# EAGLE board 7SEG_STATUS_1 (EAGLE 6.5.0)
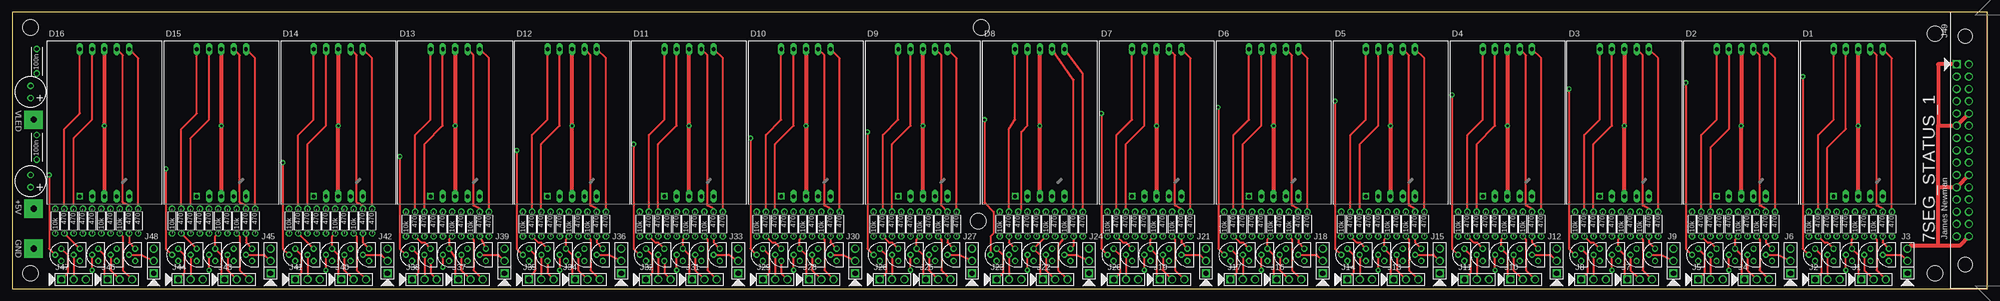
[diagram p9: board, top side]
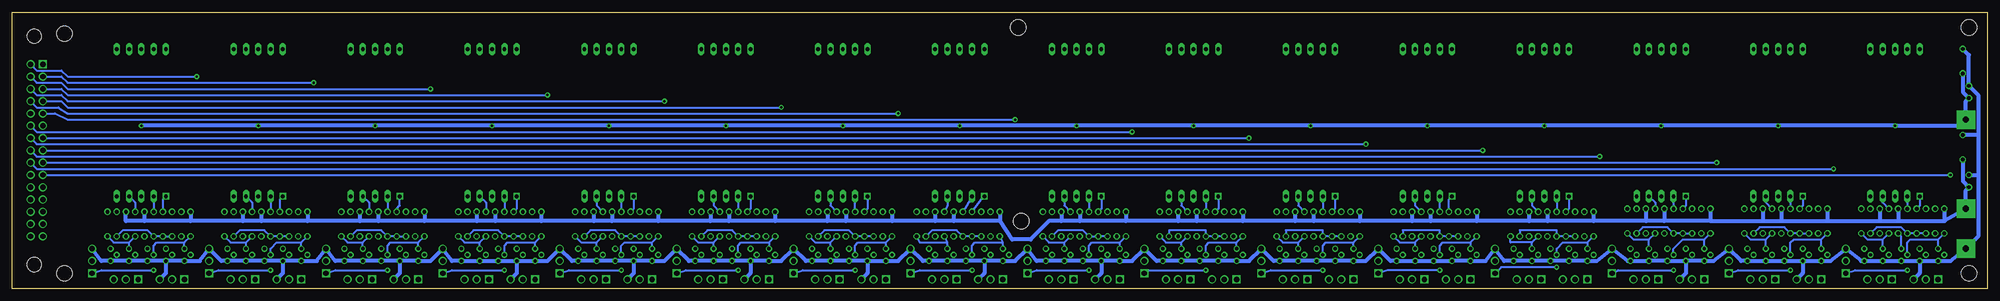
[diagram p10: board, bottom side, seen from below]

Size 407.67 x 57.15 mm. Coordinates in mm from the lower left corner, seen from the top.
Outline: 0,0 407.67,0 407.67,57.15 0,57.15 0,0
Copper layers (1*16): Top 0.035mm / dielectric 1.5mm / Bottom 0.035mm
Design rules "processor_rules_2layer": minimum track width 8mil, minimum drill 14mil, track to track 8mil, track to pad 8mil, pad to pad 8mil, via to via 8mil, smd to smd 8mil, copper to edge 40mil, drill to drill 8mil, minimum pad ring 10mil, minimum via ring 8mil, stop-mask expansion 4mil, vias tented up to drill 0mil, thermal gap 10mil

## Footprints (pad centres in the part's own frame; a part is rotated, then mirrored left to right if it is on the bottom)
POLARISED_CAP_2P5_6P3MM = drill 0.8: A 1.27,0; K -1.27,0
CAP_P2INCH = drill 0.8: 1 -2.54,0; 2 2.54,0
SA10 = drill 0.8 square: 1 -5.08,-15.2 | drill 0.8 long: 2 -2.54,-15.2; 3 0,-15.2; 4 2.54,-15.2; 5 5.08,-15.2; 6 5.08,15.2; 7 2.54,15.2; 8 0,15.2; 9 -2.54,15.2; 10 -5.08,15.2
3M_HOLE = hole 3.2: 0,0
JUMP_3X1 = drill 1.1 square: 1 -2.54,0 | drill 1.1: 2 0,0; 3 2.54,0
30_HDR_LOCKING_RA = drill 1.1 square: 1 -17.78,-1.27 | drill 1.1: 2 -17.78,1.27; 3 -15.24,-1.27; 4 -15.24,1.27; 5 -12.7,-1.27; 6 -12.7,1.27; 7 -10.16,-1.27; 8 -10.16,1.27; 9 -7.62,-1.27; 10 -7.62,1.27; 11 -5.08,-1.27; 12 -5.08,1.27; 13 -2.54,-1.27; 14 -2.54,1.27; 15 0,-1.27; 16 0,1.27; 17 2.54,-1.27; 18 2.54,1.27; 19 5.08,-1.27; 20 5.08,1.27; 21 7.62,-1.27; 22 7.62,1.27; 23 10.16,-1.27; 24 10.16,1.27; 25 12.7,-1.27; 26 12.7,1.27; 27 15.24,-1.27; 28 15.24,1.27; 29 17.78,-1.27; 30 17.78,1.27 | hole 2.946: -23.597,0.533; 23.597,0.533
POWER_PAD = drill 1.3 pad 3.81 square: 1 0,0
TO92-DGS = drill 0.7: D 0,1.27; G -1.27,0; S 0,-1.27
R_P2INCH = drill 0.8: 1 -2.54,0; 2 2.54,0

## Placement (x,y rotation side)
C1  100u  [POLARISED_CAP_2P5_6P3MM]  3.81,22.23 270 top
C2  100u  [POLARISED_CAP_2P5_6P3MM]  3.81,40.64 270 top
C3  100n  [CAP_P2INCH]  5.08,29.21 90 top
C4  100n  [CAP_P2INCH]  5.08,46.99 90 top
D1  SA10-21SRWA  [SA10]  381,34.29 0 top
D2  SA10-21SRWA  [SA10]  356.87,34.29 0 top
D3  SA10-21SRWA  [SA10]  332.74,34.29 0 top
D4  SA10-21SRWA  [SA10]  308.61,34.29 0 top
D5  SA10-21SRWA  [SA10]  284.48,34.29 0 top
D6  SA10-21SRWA  [SA10]  260.35,34.29 0 top
D7  SA10-21SRWA  [SA10]  236.22,34.29 0 top
D8  SA10-21SRWA  [SA10]  212.09,34.29 0 top
D9  SA10-21SRWA  [SA10]  187.96,34.29 0 top
D10  SA10-21SRWA  [SA10]  163.83,34.29 0 top
D11  SA10-21SRWA  [SA10]  139.7,34.29 0 top
D12  SA10-21SRWA  [SA10]  115.57,34.29 0 top
D13  SA10-21SRWA  [SA10]  91.44,34.29 0 top
D14  SA10-21SRWA  [SA10]  67.31,34.29 0 top
D15  SA10-21SRWA  [SA10]  43.18,34.29 0 top
D16  SA10-21SRWA  [SA10]  19.05,34.29 0 top
HOLE1  3M_MOUNT_HOLE  [3M_HOLE]  396.88,52.7 0 top
HOLE2  3M_MOUNT_HOLE  [3M_HOLE]  396.88,3.17 0 top
HOLE3  3M_MOUNT_HOLE  [3M_HOLE]  3.81,53.98 0 top
HOLE4  3M_MOUNT_HOLE  [3M_HOLE]  3.81,3.17 0 top
HOLE5  3M_MOUNT_HOLE  [3M_HOLE]  199.39,13.97 0 top
HOLE6  3M_MOUNT_HOLE  [3M_HOLE]  200.03,53.98 0 top
J1  JUMP_3X1  [JUMP_3X1]  384.18,1.91 0 top
J2  JUMP_3X1  [JUMP_3X1]  374.65,1.91 0 top
J3  JUMP_3X1  [JUMP_3X1]  391.16,5.71 90 top
J4  JUMP_3X1  [JUMP_3X1]  360.05,1.91 0 top
J5  JUMP_3X1  [JUMP_3X1]  350.52,1.91 0 top
J6  JUMP_3X1  [JUMP_3X1]  367.03,5.71 90 top
J7  JUMP_3X1  [JUMP_3X1]  335.92,1.91 0 top
J8  JUMP_3X1  [JUMP_3X1]  326.39,1.91 0 top
J9  JUMP_3X1  [JUMP_3X1]  342.9,5.71 90 top
J10  JUMP_3X1  [JUMP_3X1]  311.79,1.91 0 top
J11  JUMP_3X1  [JUMP_3X1]  302.26,1.91 0 top
J12  JUMP_3X1  [JUMP_3X1]  318.77,5.71 90 top
J13  JUMP_3X1  [JUMP_3X1]  287.65,1.91 0 top
J14  JUMP_3X1  [JUMP_3X1]  278.13,1.91 0 top
J15  JUMP_3X1  [JUMP_3X1]  294.64,5.71 90 top
J16  JUMP_3X1  [JUMP_3X1]  263.52,1.91 0 top
J17  JUMP_3X1  [JUMP_3X1]  254,1.91 0 top
J18  JUMP_3X1  [JUMP_3X1]  270.51,5.71 90 top
J19  JUMP_3X1  [JUMP_3X1]  239.4,1.91 0 top
J20  JUMP_3X1  [JUMP_3X1]  229.87,1.91 0 top
J21  JUMP_3X1  [JUMP_3X1]  246.38,5.71 90 top
J22  JUMP_3X1  [JUMP_3X1]  215.26,1.91 0 top
J23  JUMP_3X1  [JUMP_3X1]  205.74,1.91 0 top
J24  JUMP_3X1  [JUMP_3X1]  222.25,5.71 90 top
J25  JUMP_3X1  [JUMP_3X1]  191.13,1.91 0 top
J26  JUMP_3X1  [JUMP_3X1]  181.61,1.91 0 top
J27  JUMP_3X1  [JUMP_3X1]  198.12,5.71 90 top
J28  JUMP_3X1  [JUMP_3X1]  167,1.91 0 top
J29  JUMP_3X1  [JUMP_3X1]  157.48,1.91 0 top
J30  JUMP_3X1  [JUMP_3X1]  173.99,5.71 90 top
J31  JUMP_3X1  [JUMP_3X1]  142.88,1.91 0 top
J32  JUMP_3X1  [JUMP_3X1]  133.35,1.91 0 top
J33  JUMP_3X1  [JUMP_3X1]  149.86,5.71 90 top
J34  JUMP_3X1  [JUMP_3X1]  118.75,1.91 0 top
J35  JUMP_3X1  [JUMP_3X1]  109.22,1.91 0 top
J36  JUMP_3X1  [JUMP_3X1]  125.73,5.71 90 top
J37  JUMP_3X1  [JUMP_3X1]  94.61,1.91 0 top
J38  JUMP_3X1  [JUMP_3X1]  85.09,1.91 0 top
J39  JUMP_3X1  [JUMP_3X1]  101.6,5.71 90 top
J40  JUMP_3X1  [JUMP_3X1]  70.48,1.91 0 top
J41  JUMP_3X1  [JUMP_3X1]  60.96,1.91 0 top
J42  JUMP_3X1  [JUMP_3X1]  77.47,5.71 90 top
J43  JUMP_3X1  [JUMP_3X1]  46.35,1.91 0 top
J44  JUMP_3X1  [JUMP_3X1]  36.83,1.91 0 top
J45  JUMP_3X1  [JUMP_3X1]  53.34,5.71 90 top
J46  JUMP_3X1  [JUMP_3X1]  22.23,1.91 0 top
J47  JUMP_3X1  [JUMP_3X1]  12.7,1.91 0 top
J48  JUMP_3X1  [JUMP_3X1]  29.21,5.71 90 top
J49  30_HDR_LOCKING_RA  [30_HDR_LOCKING_RA]  402.59,28.57 270 top
PP1  POWER_PAD  [POWER_PAD]  4.45,8.26 0 top
PP2  POWER_PAD  [POWER_PAD]  4.45,16.51 0 top
PP3  POWER_PAD  [POWER_PAD]  4.45,34.92 0 top
Q1  2N7000  [TO92-DGS]  383.54,6.99 0 top
Q2  2N7000  [TO92-DGS]  375.92,6.99 0 top
Q3  2N7000  [TO92-DGS]  387.35,6.99 0 top
Q4  2N7000  [TO92-DGS]  372.11,6.99 0 top
Q5  2N7000  [TO92-DGS]  379.73,6.99 0 top
Q6  2N7000  [TO92-DGS]  359.41,6.99 0 top
Q7  2N7000  [TO92-DGS]  351.79,6.99 0 top
Q8  2N7000  [TO92-DGS]  363.22,6.99 0 top
Q9  2N7000  [TO92-DGS]  347.98,6.99 0 top
Q10  2N7000  [TO92-DGS]  355.6,6.99 0 top
Q11  2N7000  [TO92-DGS]  335.28,6.99 0 top
Q12  2N7000  [TO92-DGS]  327.66,6.99 0 top
Q13  2N7000  [TO92-DGS]  339.09,6.99 0 top
Q14  2N7000  [TO92-DGS]  323.85,6.99 0 top
Q15  2N7000  [TO92-DGS]  331.47,6.99 0 top
Q16  2N7000  [TO92-DGS]  311.15,6.99 0 top
Q17  2N7000  [TO92-DGS]  303.53,6.99 0 top
Q18  2N7000  [TO92-DGS]  314.96,6.99 0 top
Q19  2N7000  [TO92-DGS]  299.72,6.99 0 top
Q20  2N7000  [TO92-DGS]  307.34,6.99 0 top
Q21  2N7000  [TO92-DGS]  287.02,6.99 0 top
Q22  2N7000  [TO92-DGS]  279.4,6.99 0 top
Q23  2N7000  [TO92-DGS]  290.83,6.99 0 top
Q24  2N7000  [TO92-DGS]  275.59,6.99 0 top
Q25  2N7000  [TO92-DGS]  283.21,6.99 0 top
Q26  2N7000  [TO92-DGS]  262.89,6.99 0 top
Q27  2N7000  [TO92-DGS]  255.27,6.99 0 top
Q28  2N7000  [TO92-DGS]  266.7,6.99 0 top
Q29  2N7000  [TO92-DGS]  251.46,6.99 0 top
Q30  2N7000  [TO92-DGS]  259.08,6.99 0 top
Q31  2N7000  [TO92-DGS]  238.76,6.99 0 top
Q32  2N7000  [TO92-DGS]  231.14,6.99 0 top
Q33  2N7000  [TO92-DGS]  242.57,6.99 0 top
Q34  2N7000  [TO92-DGS]  227.33,6.99 0 top
Q35  2N7000  [TO92-DGS]  234.95,6.99 0 top
Q36  2N7000  [TO92-DGS]  214.63,6.99 0 top
Q37  2N7000  [TO92-DGS]  207.01,6.99 0 top
Q38  2N7000  [TO92-DGS]  218.44,6.99 0 top
Q39  2N7000  [TO92-DGS]  203.2,6.99 0 top
Q40  2N7000  [TO92-DGS]  210.82,6.99 0 top
Q41  2N7000  [TO92-DGS]  190.5,6.99 0 top
Q42  2N7000  [TO92-DGS]  182.88,6.99 0 top
Q43  2N7000  [TO92-DGS]  194.31,6.99 0 top
Q44  2N7000  [TO92-DGS]  179.07,6.99 0 top
Q45  2N7000  [TO92-DGS]  186.69,6.99 0 top
Q46  2N7000  [TO92-DGS]  166.37,6.99 0 top
Q47  2N7000  [TO92-DGS]  158.75,6.99 0 top
Q48  2N7000  [TO92-DGS]  170.18,6.99 0 top
Q49  2N7000  [TO92-DGS]  154.94,6.99 0 top
Q50  2N7000  [TO92-DGS]  162.56,6.99 0 top
Q51  2N7000  [TO92-DGS]  142.24,6.99 0 top
Q52  2N7000  [TO92-DGS]  134.62,6.99 0 top
Q53  2N7000  [TO92-DGS]  146.05,6.99 0 top
Q54  2N7000  [TO92-DGS]  130.81,6.99 0 top
Q55  2N7000  [TO92-DGS]  138.43,6.99 0 top
Q56  2N7000  [TO92-DGS]  118.11,6.99 0 top
Q57  2N7000  [TO92-DGS]  110.49,6.99 0 top
Q58  2N7000  [TO92-DGS]  121.92,6.99 0 top
Q59  2N7000  [TO92-DGS]  106.68,6.99 0 top
Q60  2N7000  [TO92-DGS]  114.3,6.99 0 top
Q61  2N7000  [TO92-DGS]  93.98,6.99 0 top
Q62  2N7000  [TO92-DGS]  86.36,6.99 0 top
Q63  2N7000  [TO92-DGS]  97.79,6.99 0 top
Q64  2N7000  [TO92-DGS]  82.55,6.99 0 top
Q65  2N7000  [TO92-DGS]  90.17,6.99 0 top
Q66  2N7000  [TO92-DGS]  69.85,6.99 0 top
Q67  2N7000  [TO92-DGS]  62.23,6.99 0 top
Q68  2N7000  [TO92-DGS]  73.66,6.99 0 top
Q69  2N7000  [TO92-DGS]  58.42,6.99 0 top
Q70  2N7000  [TO92-DGS]  66.04,6.99 0 top
Q71  2N7000  [TO92-DGS]  45.72,6.99 0 top
Q72  2N7000  [TO92-DGS]  38.1,6.99 0 top
Q73  2N7000  [TO92-DGS]  49.53,6.99 0 top
Q74  2N7000  [TO92-DGS]  34.29,6.99 0 top
Q75  2N7000  [TO92-DGS]  41.91,6.99 0 top
Q76  2N7000  [TO92-DGS]  21.59,6.99 0 top
Q77  2N7000  [TO92-DGS]  13.97,6.99 0 top
Q78  2N7000  [TO92-DGS]  25.4,6.99 0 top
Q79  2N7000  [TO92-DGS]  10.16,6.99 0 top
Q80  2N7000  [TO92-DGS]  17.78,6.99 0 top
R1  470  [R_P2INCH]  376.56,13.34 270 top
R2  470  [R_P2INCH]  374.65,13.34 270 top
R3  470  [R_P2INCH]  372.75,13.34 270 top
R4  10k  [R_P2INCH]  370.84,13.34 90 top
R5  10k  [R_P2INCH]  380.37,13.34 90 top
R6  10k  [R_P2INCH]  384.18,13.34 90 top
R7  470  [R_P2INCH]  352.43,13.34 270 top
R8  470  [R_P2INCH]  350.52,13.34 270 top
R9  470  [R_P2INCH]  348.62,13.34 270 top
R10  10k  [R_P2INCH]  346.71,13.34 90 top
R11  10k  [R_P2INCH]  356.24,13.34 90 top
R12  10k  [R_P2INCH]  360.05,13.34 90 top
R13  470  [R_P2INCH]  328.3,13.34 270 top
R14  470  [R_P2INCH]  326.39,13.34 270 top
R15  470  [R_P2INCH]  324.49,13.34 270 top
R16  10k  [R_P2INCH]  322.58,13.34 90 top
R17  10k  [R_P2INCH]  332.11,13.34 90 top
R18  10k  [R_P2INCH]  335.92,13.34 90 top
R19  470  [R_P2INCH]  304.17,13.34 270 top
R20  470  [R_P2INCH]  302.26,13.34 270 top
R21  470  [R_P2INCH]  300.36,13.34 270 top
R22  10k  [R_P2INCH]  298.45,13.34 90 top
R23  10k  [R_P2INCH]  307.98,13.34 90 top
R24  10k  [R_P2INCH]  311.79,13.34 90 top
R25  470  [R_P2INCH]  280.04,13.34 270 top
R26  470  [R_P2INCH]  278.13,13.34 270 top
R27  470  [R_P2INCH]  276.23,13.34 270 top
R28  10k  [R_P2INCH]  274.32,13.34 90 top
R29  10k  [R_P2INCH]  283.85,13.34 90 top
R30  10k  [R_P2INCH]  287.65,13.34 90 top
R31  470  [R_P2INCH]  255.91,13.34 270 top
R32  470  [R_P2INCH]  254,13.34 270 top
R33  470  [R_P2INCH]  252.09,13.34 270 top
R34  10k  [R_P2INCH]  250.19,13.34 90 top
R35  10k  [R_P2INCH]  259.71,13.34 90 top
R36  10k  [R_P2INCH]  263.52,13.34 90 top
R37  470  [R_P2INCH]  231.78,13.34 270 top
R38  470  [R_P2INCH]  229.87,13.34 270 top
R39  470  [R_P2INCH]  227.97,13.34 270 top
R40  10k  [R_P2INCH]  226.06,13.34 90 top
R41  10k  [R_P2INCH]  235.59,13.34 90 top
R42  10k  [R_P2INCH]  239.4,13.34 90 top
R43  470  [R_P2INCH]  209.55,13.34 270 top
R44  470  [R_P2INCH]  207.65,13.34 270 top
R45  470  [R_P2INCH]  205.74,13.34 270 top
R46  10k  [R_P2INCH]  203.84,13.34 90 top
R47  10k  [R_P2INCH]  213.36,13.34 90 top
R48  10k  [R_P2INCH]  217.17,13.34 90 top
R49  470  [R_P2INCH]  183.51,13.34 270 top
R50  470  [R_P2INCH]  181.61,13.34 270 top
R51  470  [R_P2INCH]  179.71,13.34 270 top
R52  10k  [R_P2INCH]  177.8,13.34 90 top
R53  10k  [R_P2INCH]  187.32,13.34 90 top
R54  10k  [R_P2INCH]  191.13,13.34 90 top
R55  470  [R_P2INCH]  159.38,13.34 270 top
R56  470  [R_P2INCH]  157.48,13.34 270 top
R57  470  [R_P2INCH]  155.57,13.34 270 top
R58  10k  [R_P2INCH]  153.67,13.34 90 top
R59  10k  [R_P2INCH]  163.19,13.34 90 top
R60  10k  [R_P2INCH]  167,13.34 90 top
R61  470  [R_P2INCH]  135.25,13.34 270 top
R62  470  [R_P2INCH]  133.35,13.34 270 top
R63  470  [R_P2INCH]  131.44,13.34 270 top
R64  10k  [R_P2INCH]  129.54,13.34 90 top
R65  10k  [R_P2INCH]  139.06,13.34 90 top
R66  10k  [R_P2INCH]  142.88,13.34 90 top
R67  470  [R_P2INCH]  111.12,13.34 270 top
R68  470  [R_P2INCH]  109.22,13.34 270 top
R69  470  [R_P2INCH]  107.31,13.34 270 top
R70  10k  [R_P2INCH]  105.41,13.34 90 top
R71  10k  [R_P2INCH]  114.94,13.34 90 top
R72  10k  [R_P2INCH]  118.75,13.34 90 top
R73  470  [R_P2INCH]  87,13.34 270 top
R74  470  [R_P2INCH]  85.09,13.34 270 top
R75  470  [R_P2INCH]  83.19,13.34 270 top
R76  10k  [R_P2INCH]  81.28,13.34 90 top
R77  10k  [R_P2INCH]  90.81,13.34 90 top
R78  10k  [R_P2INCH]  94.61,13.34 90 top
R79  470  [R_P2INCH]  62.87,13.97 270 top
R80  470  [R_P2INCH]  60.96,13.97 270 top
R81  470  [R_P2INCH]  59.05,13.97 270 top
R82  10k  [R_P2INCH]  57.15,13.97 90 top
R83  10k  [R_P2INCH]  66.67,13.97 90 top
R84  10k  [R_P2INCH]  70.48,13.97 90 top
R85  470  [R_P2INCH]  38.73,13.97 270 top
R86  470  [R_P2INCH]  36.83,13.97 270 top
R87  470  [R_P2INCH]  34.92,13.97 270 top
R88  10k  [R_P2INCH]  33.02,13.97 90 top
R89  10k  [R_P2INCH]  42.55,13.97 90 top
R90  10k  [R_P2INCH]  46.35,13.97 90 top
R91  470  [R_P2INCH]  14.61,13.97 270 top
R92  470  [R_P2INCH]  12.7,13.97 270 top
R93  470  [R_P2INCH]  10.79,13.97 270 top
R94  10k  [R_P2INCH]  8.89,13.97 90 top
R95  10k  [R_P2INCH]  18.41,13.97 90 top
R96  10k  [R_P2INCH]  22.23,13.97 90 top
R97  470  [R_P2INCH]  64.77,13.97 270 top
R98  470  [R_P2INCH]  68.58,13.97 270 top
R99  470  [R_P2INCH]  74.3,13.97 270 top
R100  470  [R_P2INCH]  72.39,13.97 270 top
R101  470  [R_P2INCH]  88.9,13.34 270 top
R102  470  [R_P2INCH]  92.71,13.34 270 top
R103  470  [R_P2INCH]  98.42,13.34 270 top
R104  470  [R_P2INCH]  96.52,13.34 270 top
R105  470  [R_P2INCH]  40.64,13.97 270 top
R106  470  [R_P2INCH]  44.45,13.97 270 top
R107  470  [R_P2INCH]  50.16,13.97 270 top
R108  470  [R_P2INCH]  48.26,13.97 270 top
R109  470  [R_P2INCH]  16.51,13.97 270 top
R110  470  [R_P2INCH]  20.32,13.97 270 top
R111  470  [R_P2INCH]  26.04,13.97 270 top
R112  470  [R_P2INCH]  24.13,13.97 270 top
R113  470  [R_P2INCH]  113.03,13.34 270 top
R114  470  [R_P2INCH]  116.84,13.34 270 top
R115  470  [R_P2INCH]  122.56,13.34 270 top
R116  470  [R_P2INCH]  120.65,13.34 270 top
R117  470  [R_P2INCH]  137.16,13.34 270 top
R118  470  [R_P2INCH]  140.97,13.34 270 top
R119  470  [R_P2INCH]  146.69,13.34 270 top
R120  470  [R_P2INCH]  144.78,13.34 270 top
R121  470  [R_P2INCH]  161.29,13.34 270 top
R122  470  [R_P2INCH]  165.1,13.34 270 top
R123  470  [R_P2INCH]  170.81,13.34 270 top
R124  470  [R_P2INCH]  168.91,13.34 270 top
R125  470  [R_P2INCH]  185.42,13.34 270 top
R126  470  [R_P2INCH]  189.23,13.34 270 top
R127  470  [R_P2INCH]  194.94,13.34 270 top
R128  470  [R_P2INCH]  193.04,13.34 270 top
R129  470  [R_P2INCH]  233.68,13.34 270 top
R130  470  [R_P2INCH]  237.49,13.34 270 top
R131  470  [R_P2INCH]  243.21,13.34 270 top
R132  470  [R_P2INCH]  241.3,13.34 270 top
R133  470  [R_P2INCH]  211.46,13.34 270 top
R134  470  [R_P2INCH]  220.98,13.34 270 top
R135  470  [R_P2INCH]  215.26,13.34 270 top
R136  470  [R_P2INCH]  219.07,13.34 270 top
R137  470  [R_P2INCH]  257.81,13.34 270 top
R138  470  [R_P2INCH]  261.62,13.34 270 top
R139  470  [R_P2INCH]  267.33,13.34 270 top
R140  470  [R_P2INCH]  265.43,13.34 270 top
R141  470  [R_P2INCH]  281.94,13.34 270 top
R142  470  [R_P2INCH]  285.75,13.34 270 top
R143  470  [R_P2INCH]  291.46,13.34 270 top
R144  470  [R_P2INCH]  289.56,13.34 270 top
R145  470  [R_P2INCH]  309.88,13.34 270 top
R146  470  [R_P2INCH]  306.07,13.34 270 top
R147  470  [R_P2INCH]  315.6,13.34 270 top
R148  470  [R_P2INCH]  313.69,13.34 270 top
R149  470  [R_P2INCH]  330.2,13.34 270 top
R150  470  [R_P2INCH]  334.01,13.34 270 top
R151  470  [R_P2INCH]  337.82,13.34 270 top
R152  470  [R_P2INCH]  339.73,13.34 270 top
R153  470  [R_P2INCH]  354.33,13.34 270 top
R154  470  [R_P2INCH]  358.14,13.34 270 top
R155  470  [R_P2INCH]  363.86,13.34 270 top
R156  470  [R_P2INCH]  361.95,13.34 270 top
R157  470  [R_P2INCH]  378.46,13.34 270 top
R158  470  [R_P2INCH]  382.27,13.34 270 top
R159  470  [R_P2INCH]  387.99,13.34 270 top
R160  470  [R_P2INCH]  386.08,13.34 270 top

## Tracks (layer width: path | path; a pad name or v marks a point on that pad's centre or on a via)
+5V
  Bottom 0.813: R76.2 81.28,13.97 | 81.28,13.97 90.81,13.97 | 90.81,13.97 94.61,13.97 | R78.2 94.61,13.97 | R77.2 90.81,13.97 | 94.61,13.97 105.41,13.97 | R70.2 105.41,13.97 | 105.41,13.97 114.94,13.97 | 114.94,13.97 118.75,13.97 | R71.2 114.94,13.97 | R72.2 118.75,13.97 | 118.75,13.97 129.54,13.97 | 129.54,13.97 139.06,13.97 | 139.06,13.97 142.88,13.97 | R64.2 129.54,13.97 | R65.2 139.06,13.97 | R66.2 142.88,13.97 | 142.88,13.97 153.67,13.97 | 153.67,13.97 163.19,13.97 | 163.19,13.97 167,13.97 | R58.2 153.67,13.97 | R59.2 163.19,13.97 | R60.2 167,13.97 | 167,13.97 177.8,13.97 | 177.8,13.97 187.32,13.97 | 187.32,13.97 191.13,13.97 | R52.2 177.8,13.97 | R53.2 187.32,13.97 | R54.2 191.13,13.97 | 191.13,13.97 193.68,13.97 197.49,10.16 201.29,10.16 203.84,13.97 | 203.84,13.97 213.36,13.97 | 213.36,13.97 217.17,13.97 | 217.17,13.97 226.06,13.97 | 226.06,13.97 235.59,13.97 | 235.59,13.97 239.4,13.97 | 239.4,13.97 250.19,13.97 | 250.19,13.97 259.71,13.97 | 259.71,13.97 263.52,13.97 | R46.2 203.84,13.97 | R47.2 213.36,13.97 | R48.2 217.17,13.97 | R40.2 226.06,13.97 | R41.2 235.59,13.97 | R42.2 239.4,13.97 | R34.2 250.19,13.97 | R36.2 263.52,13.97 | R35.2 259.71,13.97 | 263.52,13.97 274.32,13.97 | 274.32,13.97 283.85,13.97 | 283.85,13.97 287.65,13.97 | 287.65,13.97 298.45,13.97 | R22.2 298.45,13.97 | R30.2 287.65,13.97 | R28.2 274.32,13.97 | R29.2 283.85,13.97 | 298.45,13.97 307.98,13.97 | 307.98,13.97 311.79,13.97 | 311.79,13.97 322.58,13.97 | 322.58,13.97 332.11,13.97 | 332.11,13.97 335.92,13.97 | R23.2 307.98,13.97 | R24.2 311.79,13.97 | R16.2 322.58,13.97 | R17.2 332.11,13.97 | R18.2 335.92,13.97 | 335.92,13.97 346.71,13.97 | 346.71,13.97 356.24,13.97 | 356.24,13.97 360.05,13.97 | 360.05,13.97 370.84,13.97
  Bottom 0.813: 370.84,13.97 380.37,13.97 | 380.37,13.97 384.18,13.97 R6.2 | R10.2 346.71,13.97 | R11.2 356.24,13.97 | R12.2 360.05,13.97 | R5.2 380.37,13.97 | R4.2 370.84,13.97 | 57.15,13.97 66.67,13.97 | 66.67,13.97 70.48,13.97 | 70.48,13.97 81.28,13.97 | R82.2 57.15,13.97 | R83.2 66.67,13.97 | R84.2 70.48,13.97 | 57.15,13.97 46.35,13.97 | 46.35,13.97 42.55,13.97 | 42.55,13.97 33.02,13.97 | 33.02,13.97 22.23,13.97 | 22.23,13.97 18.41,13.97 | 18.41,13.97 8.89,13.97 | R90.2 46.35,13.97 | R88.2 33.02,13.97 | R89.2 42.55,13.97 | R94.2 8.89,13.97 | R96.2 22.23,13.97 | R95.2 18.41,13.97 | 8.89,13.97 PP2.1 4.45,20.32 C1.A 5.08,22.23 C3.1
D0  (via drill 0.5 pad 1.02)
  Top 0.406: v369.57,43.81 369.57,8.26 Q4.G
  Bottom 0.406: J49.2 402.59,45.09 397.51,45.09 396.24,43.81 v369.57,43.81
D1  (via drill 0.5 pad 1.02)
  Top 0.406: v345.44,42.55 345.44,8.26 Q9.G
  Bottom 0.406: J49.3 397.51,43.81 396.24,42.55 v345.44,42.55
D2  (via drill 0.5 pad 1.02)
  Top 0.406: v321.31,41.27 321.31,8.26 Q14.G
  Bottom 0.406: J49.4 402.59,42.55 397.51,42.55 396.24,41.27 v321.31,41.27
D3  (via drill 0.5 pad 1.02)
  Top 0.406: v297.18,40.01 297.18,8.26 Q19.G
  Bottom 0.406: J49.5 397.51,41.27 396.24,40.01 v297.18,40.01
D4  (via drill 0.5 pad 1.02)
  Top 0.406: v273.05,38.73 273.05,8.26 Q24.G
  Bottom 0.406: J49.6 402.59,40.01 397.51,40.01 396.24,38.73 v273.05,38.73
D5  (via drill 0.5 pad 1.02)
  Top 0.406: v248.92,37.47 248.92,8.26 Q29.G
  Bottom 0.406: J49.7 397.51,38.73 396.24,37.47 v248.92,37.47
D6  (via drill 0.5 pad 1.02)
  Top 0.406: v224.79,36.2 224.79,8.26 Q34.G
  Bottom 0.406: J49.8 402.59,37.47 398.14,37.47 396.24,36.2 v224.79,36.2
D7  (via drill 0.5 pad 1.02)
  Top 0.406: v200.66,34.92 200.66,17.78 202.56,15.88 202.56,11.43 201.93,10.79 201.93,9.53 Q39.G
  Bottom 0.406: J49.9 398.78,36.2 396.24,34.92 v200.66,34.92
D8  (via drill 0.5 pad 1.02)
  Top 0.406: v176.53,32.38 176.53,8.26 Q44.G
  Bottom 0.406: J49.12 402.59,32.38 v176.53,32.38
D9  (via drill 0.5 pad 1.02)
  Top 0.406: v152.4,31.11 152.4,8.26 Q49.G
  Bottom 0.406: J49.13 v152.4,31.11
D10  (via drill 0.5 pad 1.02)
  Top 0.406: v128.27,29.84 128.27,8.26 Q54.G
  Bottom 0.406: J49.14 402.59,29.84 v128.27,29.84
D11  (via drill 0.5 pad 1.02)
  Top 0.406: v104.14,28.57 104.14,8.26 Q59.G
  Bottom 0.406: J49.15 v104.14,28.57
D12  (via drill 0.5 pad 1.02)
  Top 0.406: v80.01,27.3 80.01,8.26 Q64.G
  Bottom 0.406: J49.16 402.59,27.3 v80.01,27.3
D13  (via drill 0.5 pad 1.02)
  Top 0.406: v55.88,26.04 55.88,8.26 Q69.G
  Bottom 0.406: J49.17 v55.88,26.04
D14  (via drill 0.5 pad 1.02)
  Top 0.406: v31.75,24.77 31.75,8.26 Q74.G
  Bottom 0.406: J49.18 402.59,24.77 v31.75,24.77
D15  (via drill 0.5 pad 1.02)
  Top 0.406: v7.62,23.5 7.62,8.26 Q79.G
  Bottom 0.406: J49.19 v7.62,23.5
DASH_EN_0
  Top 0.406: Q2.G J2.2
DASH_EN_1
  Top 0.406: Q7.G J5.2
DASH_EN_2
  Top 0.406: Q12.G J8.2
DASH_EN_3
  Top 0.406: Q17.G J11.2
DASH_EN_4
  Top 0.406: Q22.G J14.2
DASH_EN_5
  Top 0.406: Q27.G J17.2
DASH_EN_6
  Top 0.406: Q32.G J20.2
DASH_EN_7
  Top 0.406: Q37.G J23.2
DASH_EN_8
  Top 0.406: Q42.G J26.2
DASH_EN_9
  Top 0.406: Q47.G J29.2
DASH_EN_10
  Top 0.406: Q52.G J32.2
DASH_EN_11
  Top 0.406: Q57.G J35.2
DASH_EN_12
  Top 0.406: Q62.G J38.2
DASH_EN_13
  Top 0.406: Q67.G J41.2
DASH_EN_14
  Top 0.406: Q72.G J44.2
DASH_EN_15
  Top 0.406: Q77.G J47.2
EN_0
  Top 0.406: J1.1 381,2.54 381,6.99 Q5.D 379.73,10.16 R5.1
EN_1
  Top 0.406: R11.1 355.6,10.16 Q10.D 356.87,6.99 356.87,2.54 J4.1
EN_2
  Top 0.406: J7.1 332.74,2.54 332.74,6.99 Q15.D 331.47,10.16 R17.1
EN_3
  Top 0.406: J10.1 308.61,2.54 308.61,6.99 Q20.D 307.34,10.16 R23.1
EN_4
  Top 0.406: J13.1 284.48,2.54 284.48,6.99 Q25.D 283.21,10.16 R29.1
EN_5
  Top 0.406: J16.1 260.35,2.54 260.35,6.99 Q30.D 259.08,10.16 R35.1
EN_6
  Top 0.406: J19.1 236.22,2.54 236.22,6.99 Q35.D 234.95,10.16 R41.1
EN_7
  Top 0.406: R47.1 Q40.D 212.09,6.99 212.09,2.54 J22.1
EN_8
  Top 0.406: J25.1 187.96,2.54 187.96,6.99 Q45.D 186.69,10.16 R53.1
EN_9
  Top 0.406: J28.1 163.83,2.54 163.83,6.99 Q50.D 162.56,10.16 R59.1
EN_10
  Top 0.406: R65.1 138.43,10.16 Q55.D 139.7,6.99 139.7,2.54 J31.1
EN_11
  Top 0.406: J34.1 115.57,2.54 115.57,6.99 Q60.D 114.3,10.16 R71.1
EN_12
  Top 0.406: J37.1 91.44,2.54 91.44,6.35 Q65.D 90.17,10.16 R77.1
EN_13
  Top 0.406: R83.1 66.04,10.79 Q70.D 67.31,6.99 67.31,2.54 J40.1
EN_14
  Top 0.406: J43.1 43.18,2.54 43.18,6.99 Q75.D 41.91,10.79 R89.1
EN_15
  Top 0.406: Q80.D 19.05,6.99 19.05,2.54 J46.1
  Bottom 0.406: Q80.D 17.78,10.79 R95.1
EN_N_0  (via drill 0.5 pad 1.02)
  Top 0.406: v378.46,3.81 Q5.G | Q4.D 373.38,6.99 373.38,3.17 J2.1
  Bottom 0.406: Q4.D 372.11,9.53 | 372.11,9.53 R4.1 | Q5.G 378.46,8.89 377.82,9.53 372.11,9.53 | J3.1 389.25,3.81 v378.46,3.81
EN_N_1  (via drill 0.5 pad 1.02)
  Top 0.406: v354.33,3.81 Q10.G | Q9.D 349.25,6.99 349.25,3.17 J5.1
  Bottom 0.406: Q9.D 347.98,9.53 | 347.98,9.53 R10.1 | Q10.G 354.33,8.26 353.06,9.53 347.98,9.53 | J6.1 365.12,3.81 v354.33,3.81
EN_N_2  (via drill 0.5 pad 1.02)
  Top 0.406: v330.2,3.81 Q15.G | Q14.D 325.12,6.99 325.12,3.17 J8.1
  Bottom 0.406: Q14.D 323.85,9.53 | 323.85,9.53 R16.1 | Q15.G 330.2,8.89 329.56,9.53 323.85,9.53 | J9.1 341,3.81 v330.2,3.81
EN_N_3  (via drill 0.5 pad 1.02)
  Top 0.406: v306.07,3.81 Q20.G | Q19.D 300.99,6.99 300.99,3.17 J11.1
  Bottom 0.406: Q19.D 299.72,9.53 | 299.72,9.53 R22.1 | Q20.G 306.07,8.89 305.44,9.53 299.72,9.53 | J12.1 316.87,3.81 v306.07,3.81
EN_N_4  (via drill 0.5 pad 1.02)
  Top 0.406: v281.94,3.81 Q25.G | Q24.D 276.86,6.99 276.86,3.17 J14.1
  Bottom 0.406: Q24.D 275.59,9.53 | 275.59,9.53 R28.1 | Q25.G 281.94,8.89 281.31,9.53 275.59,9.53 | J15.1 292.74,3.81 v281.94,3.81
EN_N_5  (via drill 0.5 pad 1.02)
  Top 0.406: v257.81,3.81 Q30.G | Q29.D 252.73,6.99 252.73,3.17 J17.1
  Bottom 0.406: Q30.G 257.81,8.89 257.18,9.53 251.46,9.53 | 251.46,9.53 Q29.D | R34.1 251.46,9.53 | J18.1 268.61,3.81 v257.81,3.81
EN_N_6  (via drill 0.5 pad 1.02)
  Top 0.406: v233.68,3.81 Q35.G | Q34.D 228.6,6.99 228.6,3.17 J20.1
  Bottom 0.406: Q34.D 227.33,9.53 | 227.33,9.53 R40.1 | Q35.G 233.68,8.89 233.04,9.53 227.33,9.53 | J21.1 244.47,3.81 v233.68,3.81
EN_N_7  (via drill 0.5 pad 1.02)
  Top 0.406: v209.55,3.81 Q40.G | Q39.D 204.47,6.99 204.47,3.17 J23.1
  Bottom 0.406: Q39.D 203.2,9.53 | 203.2,9.53 R46.1 | Q40.G 209.55,8.89 208.91,9.53 203.2,9.53 | J24.1 220.34,3.81 v209.55,3.81
EN_N_8  (via drill 0.5 pad 1.02)
  Top 0.406: v185.42,3.81 Q45.G | Q44.D 180.34,6.99 180.34,3.17 J26.1
  Bottom 0.406: Q44.D 179.07,9.53 | 179.07,9.53 R52.1 | Q45.G 185.42,8.89 184.78,9.53 179.07,9.53 | J27.1 196.22,3.81 v185.42,3.81
EN_N_9  (via drill 0.5 pad 1.02)
  Top 0.406: v161.29,3.81 Q50.G | Q49.D 156.21,6.99 156.21,3.17 J29.1
  Bottom 0.406: Q49.D 154.94,9.53 | 154.94,9.53 R58.1 | Q50.G 161.29,8.89 160.66,9.53 154.94,9.53 | J30.1 173.35,3.81 v161.29,3.81
EN_N_10  (via drill 0.5 pad 1.02)
  Top 0.406: v137.16,3.81 Q55.G | Q54.D 132.08,6.99 132.08,3.17 J32.1
  Bottom 0.406: Q54.D 130.81,9.53 | 130.81,9.53 R64.1 | Q55.G 137.16,8.89 136.53,9.53 130.81,9.53 | J33.1 147.96,3.81 v137.16,3.81
EN_N_11  (via drill 0.5 pad 1.02)
  Top 0.406: Q59.D 107.95,6.99 107.95,3.81 J35.1 | Q60.G v113.03,3.81
  Bottom 0.406: Q60.G 113.03,8.89 112.39,9.53 106.68,9.53 | 106.68,9.53 Q59.D | R70.1 106.68,9.53 | v113.03,3.81 123.83,3.81 J36.1
EN_N_12  (via drill 0.5 pad 1.02)
  Top 0.406: Q64.D 83.82,6.99 83.82,3.17 J38.1 | Q65.G v88.9,4.45
  Bottom 0.406: Q65.G 88.9,8.26 87.63,9.53 82.55,9.53 | 82.55,9.53 Q64.D | v88.9,4.45 100.33,4.45 J39.1 | R76.1 82.55,9.53
EN_N_13  (via drill 0.5 pad 1.02)
  Top 0.406: v64.77,3.81 Q70.G | Q69.D 59.69,6.99 59.69,3.17 J41.1
  Bottom 0.406: Q69.D 58.42,10.16 | 58.42,10.16 R82.1 | Q70.G 64.77,8.26 62.87,10.16 58.42,10.16 | J42.1 76.2,3.81 v64.77,3.81
EN_N_14  (via drill 0.5 pad 1.02)
  Top 0.406: v40.64,3.81 Q75.G | Q74.D 35.56,6.99 35.56,3.17 J44.1
  Bottom 0.406: Q74.D 34.29,10.16 | 34.29,10.16 R88.1 | Q75.G 40.64,9.53 40.01,10.16 34.29,10.16 | J45.1 51.44,3.81 v40.64,3.81
EN_N_15  (via drill 0.5 pad 1.02)
  Top 0.406: v16.51,3.81 Q80.G | Q79.D 11.43,6.99 11.43,3.17 J47.1
  Bottom 0.406: Q79.D 10.16,10.16 | 10.16,10.16 R94.1 | Q80.G 16.51,9.53 15.88,10.16 10.16,10.16 | J48.1 27.3,3.81 v16.51,3.81
GND
  Top 0.406: Q62.S 86.36,3.17 J38.3 | Q57.S 110.49,3.17 J35.3 | Q52.S 134.62,3.17 J32.3 | Q47.S 158.75,3.17 J29.3
  Top 0.813: J49.1 397.51,46.35 397.51,33.66 | 397.51,33.66 J49.11 J49.10 | 397.51,20.95 J49.21 J49.20 | 397.51,20.95 397.51,33.66 | J49.30 401.95,8.89 397.51,8.89 | 397.51,8.89 397.51,20.95 | 397.51,8.89 391.8,8.89 J3.3
  Bottom 0.813: Q42.S Q44.S 176.53,5.71 J30.3 171.45,5.71 Q48.S Q46.S Q50.S Q47.S Q49.S 152.4,5.71 J33.3 147.32,5.71 Q53.S Q51.S Q55.S Q52.S Q54.S 128.27,5.71 J36.3 123.19,5.71 Q58.S Q56.S Q60.S Q57.S Q59.S 103.5,5.71 J39.3 99.69,5.71 Q63.S Q61.S Q65.S Q62.S Q64.S 80.64,5.71 J42.3 74.3,5.71 Q68.S Q66.S Q70.S Q67.S | Q42.S Q45.S Q41.S Q43.S 196.22,5.71 J27.3 200.66,5.71 Q39.S Q37.S | Q42.S 182.88,3.17 J26.3 | Q37.S Q40.S Q36.S Q38.S 219.71,5.71 J24.3 224.79,5.71 Q34.S Q32.S | Q37.S 207.01,3.17 J23.3 | Q32.S Q35.S Q31.S Q33.S 243.84,5.71 J21.3 248.92,5.71 Q29.S Q27.S | Q32.S 231.14,3.17 J20.3 | Q27.S Q30.S Q26.S Q28.S 267.97,5.71 J18.3 273.05,5.71 Q24.S Q22.S | Q27.S 255.27,3.17 J17.3 | Q22.S 279.4,3.17 J14.3 | Q22.S Q25.S Q21.S Q23.S 292.1,5.71 J15.3 297.18,5.71 Q19.S Q17.S | Q17.S Q20.S Q16.S Q18.S 316.87,5.71 J12.3 321.31,5.71 Q14.S Q12.S | Q17.S 303.53,3.17 J11.3 | Q12.S 327.66,3.17 J8.3 | Q12.S Q15.S Q11.S Q13.S 341,5.71 J9.3 344.81,5.71 Q9.S Q7.S | Q7.S Q10.S Q6.S Q8.S 364.49,5.71 J6.3 368.94,5.71 Q4.S Q2.S | Q7.S 351.79,3.17 J5.3 | Q2.S Q5.S Q1.S Q3.S 389.25,5.71 J3.3 | Q2.S 375.92,3.17 J2.3 | Q67.S 62.23,3.17 J41.3 | Q67.S Q69.S 56.52,5.71 J45.3 50.8,5.71 Q73.S Q71.S Q75.S Q72.S | Q72.S 38.1,3.17 J44.3 | Q72.S Q74.S 32.38,5.71 J48.3 26.04,5.71 Q78.S Q76.S Q80.S Q77.S | Q77.S 13.97,3.17 J47.3 | Q77.S Q79.S 7.62,5.71 PP1.1 1.91,10.79 1.91,23.5 | C4.2 3.81,48.26 C2.K 1.91,40.01 1.91,31.75 | 1.91,31.75 C3.2 4.45,31.75 | 1.91,31.75 1.91,23.5 | C1.K 1.91,23.5
LED_SUPPLY  (via drill 0.5 pad 1.02)
  Top 0.813: D16.8 v19.05,33.66 D16.3 | D1.8 v381,33.66 D1.3 | D2.8 v356.87,33.66 D2.3 | D3.8 v332.74,33.66 D3.3 | D4.8 v308.61,33.66 D4.3 | D6.8 v260.35,33.66 D6.3 | D5.8 v284.48,33.66 D5.3 | D15.8 v43.18,33.66 D15.3 | D14.8 v67.31,33.66 D14.3 | D13.8 v91.44,33.66 D13.3 | D12.3 v115.57,33.66 D12.8 | D11.3 v139.7,33.66 D11.8 | D10.8 v163.83,33.66 D10.3 | D9.3 v187.96,33.66 D9.8 | D7.8 v236.22,33.66 D7.3 | D8.3 v212.09,33.66 D8.8
  Bottom 0.813: v381,33.66 v356.87,33.66 v332.74,33.66 v308.61,33.66 v284.48,33.66 v260.35,33.66 v236.22,33.66 v212.09,33.66 v187.96,33.66 v163.83,33.66 v139.7,33.66 v115.57,33.66 v91.44,33.66 v67.31,33.66 v43.18,33.66 v19.05,33.66 5.71,33.66 PP3.1 4.45,38.73 C2.A 5.08,40.64 C4.1
N$1
  Top 0.406: R156.1 361.95,16.51 360.68,17.14 360.68,48.22 D2.7
N$3
  Top 0.406: R155.1 363.86,47.59 D2.6
N$4
  Bottom 0.406: D2.4 359.41,19.05 358.14,17.78 R154.1
N$5
  Bottom 0.406: D2.2 R153.1
N$6
  Top 0.406: R160.1 386.08,16.51 384.81,17.14 384.81,48.22 D1.7
N$7
  Bottom 0.406: D2.1 351.79,19.05 352.43,18.41 R7.1
N$8
  Top 0.406: D2.9 354.33,33.02 350.52,29.21 R8.1
N$9
  Top 0.406: R12.1 360.68,10.16 360.68,3.81 J4.3
N$10
  Top 0.406: R6.1 384.81,10.16 384.81,3.81 J1.3
N$11
  Top 0.406: R9.1 348.62,31.75 351.79,34.92 D2.10
N$12
  Top 0.406: R151.1 337.82,16.51 336.55,17.14 336.55,48.22 D3.7
N$13
  Top 0.406: R148.1 313.69,16.51 312.42,17.14 312.42,48.22 D4.7
N$14
  Top 0.406: R147.1 315.6,47.59 D4.6
N$15
  Top 0.406: R18.1 336.55,10.16 336.55,3.81 J7.3
N$16
  Bottom 0.406: D4.4 311.15,19.05 309.88,17.78 R145.1
N$17
  Bottom 0.406: D4.2 R146.1
N$18
  Bottom 0.406: D4.1 303.53,16.51 R19.1
N$19
  Top 0.406: R20.1 302.26,29.84 306.07,33.66 D4.9
N$20
  Top 0.406: R24.1 312.42,10.16 312.42,3.81 J10.3
N$21
  Top 0.406: R27.2 277.5,9.53 278.13,9.53 Q22.D
N$22
  Top 0.406: R140.1 265.43,16.51 264.16,17.14 264.16,48.22 D6.7
N$23
  Top 0.406: R139.1 267.33,47.59 D6.6
N$24
  Bottom 0.406: D6.4 262.89,17.14 R138.1
N$25
  Top 0.406: R30.1 288.29,10.16 288.29,3.81 J13.3
N$26
  Bottom 0.406: D6.2 R137.1
N$27
  Bottom 0.406: D6.1 255.27,16.51 R31.1
N$28
  Top 0.406: R32.1 254,29.84 257.81,33.66 D6.9
N$29
  Bottom 0.406: Q21.D 287.02,9.53 | 287.02,9.53 R142.2 | R143.2 290.19,9.53 287.02,9.53
N$30
  Top 0.406: R36.1 264.16,10.16 264.16,3.81 J16.3
N$31
  Top 0.406: R132.1 241.3,16.51 240.03,17.14 240.03,48.22 D7.7
N$32
  Top 0.406: R131.1 243.21,47.59 D7.6
N$33
  Bottom 0.406: D7.4 238.76,17.14 R130.1
N$34
  Bottom 0.406: R129.1 D7.2
N$35
  Top 0.406: R42.1 240.03,10.16 240.03,3.81 J19.3
N$36
  Bottom 0.406: D7.1 231.14,16.51 R37.1
N$37
  Top 0.406: R38.1 229.87,29.84 233.68,33.66 D7.9
N$38
  Top 0.406: R39.1 227.97,31.75 231.14,34.92 D7.10
N$39
  Top 0.406: R136.1 219.07,43.14 D8.7
N$40
  Top 0.406: R48.1 215.9,8.89 215.9,3.81 J22.3
N$41
  Top 0.406: R39.2 229.24,9.53 229.87,9.53 Q32.D
N$42
  Top 0.406: R128.1 191.77,17.14 191.77,48.22 D9.7
N$43
  Top 0.406: R57.1 155.57,31.75 158.75,34.92 D10.10
N$44
  Top 0.406: R56.1 157.48,29.84 161.29,33.66 D10.9
N$45
  Top 0.406: R54.1 191.77,10.16 191.77,3.81 J25.3
N$46
  Bottom 0.406: D10.1 158.75,16.51 R55.1
N$47
  Bottom 0.406: D10.2 R121.1
N$48
  Bottom 0.406: D10.4 166.37,17.14 R122.1
N$49
  Top 0.406: R123.1 170.81,47.59 D10.6
N$50
  Top 0.406: R60.1 167.64,10.16 167.64,3.81 J28.3
N$51
  Top 0.406: R63.2 132.72,9.53 133.35,9.53 Q52.D
N$52
  Bottom 0.406: Q51.D 142.24,9.53 | 142.24,9.53 R118.2 | R119.2 145.41,9.53 142.24,9.53
N$53
  Top 0.406: R119.1 146.69,47.59 D11.6
N$54
  Top 0.406: R116.1 120.65,16.51 119.38,17.14 119.38,48.22 D12.7
N$55
  Top 0.406: R66.1 143.51,10.16 143.51,3.81 J31.3
N$56
  Top 0.406: R115.1 122.56,47.59 D12.6
N$57
  Bottom 0.406: D12.4 118.11,17.14 R114.1
N$58
  Bottom 0.406: R113.1 D12.2
N$59
  Bottom 0.406: D11.4 142.24,17.14 R118.1
N$60
  Top 0.406: R72.1 119.38,10.16 119.38,3.81 J34.3
N$61
  Top 0.406: R75.1 83.19,31.75 86.36,34.92 D13.10
N$62
  Top 0.406: R74.1 85.09,29.84 88.9,33.66 D13.9
N$63
  Bottom 0.406: D13.1 86.36,16.51 R73.1
N$64
  Bottom 0.406: D13.2 R101.1
N$65
  Top 0.406: R78.1 95.25,10.16 95.25,3.81 J37.3
N$66
  Top 0.406: R100.1 72.39,17.14 71.12,17.78 71.12,48.22 D14.7
N$67
  Top 0.406: R99.1 74.3,47.59 D14.6
N$68
  Bottom 0.406: D14.4 68.58,17.78 R98.1
N$69
  Bottom 0.406: D14.2 R97.1
N$70
  Top 0.406: R84.1 71.12,10.79 71.12,3.81 J40.3
N$71
  Top 0.406: R87.1 34.92,33.02 38.1,36.2 D15.10
N$72
  Top 0.406: R86.1 36.83,31.11 40.64,34.92 D15.9
N$73
  Bottom 0.406: D15.1 38.1,17.14 R85.1
N$74
  Bottom 0.406: D14.1 62.23,17.14 R79.1
N$75
  Top 0.406: R90.1 46.99,10.79 46.99,3.81 J43.3
N$76
  Top 0.406: R93.1 10.79,33.02 13.97,36.2 D16.10
N$77
  Top 0.406: R92.1 12.7,31.11 16.51,34.92 D16.9
N$78
  Bottom 0.406: D16.1 13.97,17.14 R91.1
N$79
  Bottom 0.406: D16.2 R109.1
N$80
  Top 0.406: R96.1 22.86,10.79 22.86,3.81 J46.3
N$81
  Top 0.406: R80.1 60.96,29.84 64.77,33.66 D14.9
N$82
  Bottom 0.406: D16.4 21.59,17.78 R110.1
N$83
  Top 0.406: R111.1 26.04,47.59 D16.6
N$84
  Bottom 0.406: D15.2 R105.1
N$85
  Bottom 0.406: D15.4 45.72,17.78 R106.1
N$86
  Top 0.406: R107.1 50.16,47.59 D15.6
N$87
  Top 0.406: R81.1 59.05,31.75 62.23,34.92 D14.10
N$88
  Bottom 0.406: D13.4 93.98,17.14 R102.1
N$89
  Bottom 0.406: Q66.D 69.85,10.16 | 69.85,10.16 R98.2 | R99.2 73.03,10.16 69.85,10.16
N$90
  Top 0.406: R103.1 98.42,47.59 D13.6
N$91
  Top 0.406: R81.2 Q67.D
N$92
  Top 0.406: R100.2 72.39,9.53 Q68.D
  Bottom 0.406: R80.2 R79.2 R97.2 66.04,12.7 71.12,12.7 R100.2
N$93
  Top 0.406: R104.1 96.52,16.51 95.25,17.14 95.25,48.22 D13.7
N$94
  Top 0.406: R75.2 84.45,9.53 85.09,9.53 Q62.D
N$95
  Bottom 0.406: R102.2 93.98,9.53 | 93.98,9.53 98.42,9.53 R103.2 | Q61.D 93.98,9.53
N$96
  Top 0.406: R104.2 Q63.D
  Bottom 0.406: R104.2 96.52,12.06 88.9,12.06 R101.2 R73.2 R74.2
N$97
  Top 0.406: R108.1 48.26,17.14 46.99,17.78 46.99,48.22 D15.7
N$98
  Top 0.406: R87.2 Q72.D
N$99
  Bottom 0.406: Q71.D 45.72,10.16 | 45.72,10.16 R106.2 | R107.2 48.9,10.16 45.72,10.16
N$100
  Top 0.406: R108.2 48.26,9.53 Q73.D
  Bottom 0.406: R86.2 R85.2 R105.2 41.91,12.7 46.99,12.7 R108.2
N$101
  Top 0.406: R112.1 24.13,17.14 22.86,17.78 22.86,48.22 D16.7
N$102
  Top 0.406: R93.2 Q77.D
N$103
  Bottom 0.406: Q76.D 21.59,10.16 | 21.59,10.16 R110.2 | R111.2 24.77,10.16 21.59,10.16
N$104
  Top 0.406: R112.2 24.13,9.53 Q78.D
  Bottom 0.406: R92.2 R91.2 R109.2 17.78,12.7 22.86,12.7 R112.2
N$105
  Top 0.406: R124.1 168.91,16.51 167.64,17.14 167.64,48.22 D10.7
N$106
  Bottom 0.406: R67.1 111.12,18.45 D12.1
N$107
  Top 0.406: R68.1 109.22,29.84 113.03,33.66 D12.9
N$108
  Top 0.406: R69.1 107.31,31.75 110.49,34.92 D12.10
N$109
  Top 0.406: R116.2 120.65,9.53 Q58.D
  Bottom 0.406: R68.2 R67.2 R113.2 113.03,12.06 120.65,12.06 R116.2
N$110
  Bottom 0.406: R114.2 118.11,9.53 | 118.11,9.53 Q56.D | R115.2 121.28,9.53 118.11,9.53
N$111
  Top 0.406: R69.2 108.58,9.53 109.22,9.53 Q57.D
N$112
  Bottom 0.406: D11.2 R117.1
N$113
  Bottom 0.406: D11.1 134.62,16.51 R61.1
N$114
  Top 0.406: R62.1 133.35,29.84 137.16,33.66 D11.9
N$115
  Top 0.406: R63.1 131.44,31.75 134.62,34.92 D11.10
N$116
  Top 0.406: R120.1 144.78,16.51 143.51,17.14 143.51,48.22 D11.7
N$117
  Top 0.406: R120.2 144.78,9.53 Q53.D
  Bottom 0.406: R62.2 R61.2 R117.2 137.16,12.06 144.78,12.06 R120.2
N$118
  Top 0.406: R57.2 156.84,9.53 157.48,9.53 Q47.D
N$119
  Bottom 0.406: Q46.D 166.37,9.53 | 166.37,9.53 R122.2 | R123.2 169.54,9.53 166.37,9.53
N$120
  Top 0.406: R124.2 168.91,9.53 Q48.D
  Bottom 0.406: R56.2 R55.2 R121.2 161.29,12.06 168.91,12.06 R124.2
N$121
  Top 0.406: R127.1 194.94,47.59 D9.6
N$122
  Bottom 0.406: D9.4 190.5,17.14 R126.1
N$123
  Bottom 0.406: D9.2 R125.1
N$124
  Bottom 0.406: D9.1 182.88,16.51 R49.1
N$125
  Top 0.406: R50.1 181.61,29.84 185.42,33.66 D9.9
N$126
  Top 0.406: R51.1 179.71,31.75 182.88,34.92 D9.10
N$127
  Top 0.406: R51.2 180.97,9.53 181.61,9.53 Q42.D
N$128
  Bottom 0.406: Q41.D 190.5,9.53 | 190.5,9.53 R126.2 | R127.2 193.68,9.53 190.5,9.53
N$129
  Top 0.406: R128.2 193.04,9.53 Q43.D
  Bottom 0.406: R50.2 R49.2 R125.2 186.69,12.06 191.77,12.06 R128.2
N$130
  Bottom 0.406: Q31.D 238.76,9.53 | 238.76,9.53 R130.2 | R131.2 241.94,9.53 238.76,9.53
N$131
  Top 0.406: R134.1 220.98,44.41 D8.6
N$132
  Bottom 0.406: D8.4 214.63,17.14 R135.1
N$133
  Bottom 0.406: D8.2 R133.1
N$134
  Bottom 0.406: R43.1 207.65,18.45 D8.1
N$135
  Top 0.406: R44.1 208.28,16.51 208.28,32.38 209.55,33.66 D8.9
N$136
  Top 0.406: R45.1 205.74,33.02 207.01,34.92 D8.10
N$137
  Top 0.406: R45.2 205.74,9.53 Q37.D
N$138
  Bottom 0.406: Q36.D 214.63,9.53 | 214.63,9.53 R135.2 | R134.2 220.34,9.53 214.63,9.53
N$139
  Top 0.406: R136.2 219.07,8.89 Q38.D
  Bottom 0.406: R44.2 R43.2 R133.2 212.72,12.06 217.81,12.06 R136.2
N$140
  Top 0.406: R132.2 241.3,9.53 Q33.D
  Bottom 0.406: R38.2 R37.2 R129.2 234.95,12.06 240.03,12.06 R132.2
N$141
  Top 0.406: R33.1 252.09,31.75 255.27,34.92 D6.10
N$142
  Bottom 0.406: Q26.D 262.89,9.53 | 262.89,9.53 R138.2 | R139.2 266.06,9.53 262.89,9.53
N$143
  Top 0.406: R33.2 253.37,9.53 254,9.53 Q27.D
N$144
  Top 0.406: R140.2 265.43,9.53 Q28.D
  Bottom 0.406: R32.2 R31.2 R137.2 259.08,12.06 264.16,12.06 R140.2
N$145
  Top 0.406: R144.2 289.56,9.53 Q23.D
  Bottom 0.406: R26.2 R25.2 R141.2 283.21,12.06 288.29,12.06 R144.2
N$146
  Top 0.406: R144.1 289.56,16.51 288.29,17.14 288.29,48.22 D5.7
N$147
  Top 0.406: R143.1 291.46,47.59 D5.6
N$148
  Bottom 0.406: D5.4 287.02,17.14 R142.1
N$149
  Bottom 0.406: D5.2 R141.1
N$150
  Bottom 0.406: D5.1 279.4,16.51 R25.1
N$151
  Top 0.406: R26.1 278.13,29.84 281.94,33.66 D5.9
N$152
  Top 0.406: R27.1 276.23,31.75 279.4,34.92 D5.10
N$153
  Top 0.406: R21.1 300.36,31.75 303.53,34.92 D4.10
N$154
  Top 0.406: R21.2 301.62,9.53 302.26,9.53 Q17.D
N$155
  Bottom 0.406: Q16.D 311.15,9.53 | 311.15,9.53 R145.2 | R147.2 314.32,9.53 311.15,9.53
N$156
  Top 0.406: R148.2 313.69,9.53 Q18.D
  Bottom 0.406: R20.2 R19.2 R146.2 307.34,12.06 312.42,12.06 R148.2
N$157
  Top 0.406: R152.1 339.73,47.59 D3.6
N$158
  Bottom 0.406: D3.4 335.28,19.05 334.01,17.78 R150.1
N$159
  Bottom 0.406: D3.2 R149.1
N$160
  Bottom 0.406: R13.1 328.3,16.51 327.66,17.14 D3.1
N$161
  Top 0.406: R14.1 326.39,29.84 330.2,33.66 D3.9
N$162
  Top 0.406: R15.1 324.49,31.75 327.66,34.92 D3.10
N$163
  Top 0.406: R15.2 325.75,9.53 326.39,9.53 Q12.D
N$164
  Bottom 0.406: Q11.D 335.28,9.53 | 335.28,9.53 R150.2 | R152.2 338.45,9.53 335.28,9.53
N$165
  Top 0.406: R151.2 337.82,9.53 Q13.D
  Bottom 0.406: R14.2 R13.2 R149.2 331.47,12.06 336.55,12.06 R151.2
N$166
  Top 0.406: R9.2 349.88,9.53 350.52,9.53 Q7.D
N$167
  Bottom 0.406: Q6.D 359.41,9.53 | 359.41,9.53 R154.2 | R155.2 362.58,9.53 359.41,9.53
N$168
  Top 0.406: R156.2 361.95,9.53 Q8.D
  Bottom 0.406: R8.2 R7.2 R153.2 355.6,12.06 360.68,12.06 R156.2
N$169
  Top 0.406: R159.1 387.99,47.59 D1.6
N$170
  Bottom 0.406: D1.4 383.54,19.05 382.27,17.78 R158.1
N$171
  Bottom 0.406: D1.2 R157.1
N$172
  Bottom 0.406: D1.1 375.92,19.05 376.56,18.41 R1.1
N$173
  Top 0.406: R2.1 374.65,29.21 378.46,33.02 D1.9
N$174
  Top 0.406: R3.1 372.75,31.75 375.92,34.92 D1.10
N$175
  Top 0.406: R3.2 374.01,9.53 374.65,9.53 Q2.D
N$176
  Bottom 0.406: Q1.D 383.54,9.53 | 383.54,9.53 R158.2 | R159.2 386.71,9.53 383.54,9.53
N$177
  Top 0.406: R160.2 386.08,9.53 Q3.D
  Bottom 0.406: R2.2 R1.2 R157.2 379.73,12.06 384.81,12.06 R160.2
ONE_EN_0
  Top 0.406: Q1.G 382.27,3.81 J1.2
ONE_EN_1
  Top 0.406: Q6.G 358.14,3.81 J4.2
ONE_EN_2
  Top 0.406: Q11.G 334.01,3.81 J7.2
ONE_EN_3
  Top 0.406: Q16.G 309.88,3.81 J10.2
ONE_EN_4
  Top 0.406: Q21.G 285.75,3.81 J13.2
ONE_EN_5
  Top 0.406: Q26.G 261.62,3.81 J16.2
ONE_EN_6
  Top 0.406: Q31.G 237.49,3.81 J19.2
ONE_EN_7
  Top 0.406: Q36.G 213.36,3.81 J22.2
ONE_EN_8
  Top 0.406: Q41.G 189.23,3.81 J25.2
ONE_EN_9
  Top 0.406: Q46.G 165.1,3.81 J28.2
ONE_EN_10
  Top 0.406: Q51.G 140.97,3.81 J31.2
ONE_EN_11
  Top 0.406: Q56.G 116.84,3.81 J34.2
ONE_EN_12
  Top 0.406: Q61.G 92.71,3.81 J37.2
ONE_EN_13
  Top 0.406: Q66.G 68.58,3.81 J40.2
ONE_EN_14
  Top 0.406: Q71.G 44.45,3.81 J43.2
ONE_EN_15
  Top 0.406: Q76.G 20.32,3.81 J46.2
ZERO_EN_0
  Top 0.406: Q3.G 389.89,6.99 J3.2
ZERO_EN_1
  Top 0.406: Q8.G 364.49,6.99 J6.2
ZERO_EN_2
  Top 0.406: Q13.G 340.36,6.99 J9.2
ZERO_EN_3
  Top 0.406: Q18.G 317.5,6.99 J12.2
ZERO_EN_4
  Top 0.406: Q23.G 293.37,6.99 J15.2
ZERO_EN_5
  Top 0.406: Q28.G 269.24,6.99 J18.2
ZERO_EN_6
  Top 0.406: Q33.G 245.11,6.99 J21.2
ZERO_EN_7
  Top 0.406: Q38.G 219.71,6.99 J24.2
ZERO_EN_8
  Top 0.406: Q43.G 195.58,6.99 J27.2
ZERO_EN_9
  Top 0.406: Q48.G 171.45,6.99 J30.2
ZERO_EN_10
  Top 0.406: Q53.G 147.96,6.99 J33.2
ZERO_EN_11
  Top 0.406: Q58.G 123.19,6.99 J36.2
ZERO_EN_12
  Top 0.406: Q63.G 100.33,6.99 J39.2
ZERO_EN_13
  Top 0.406: Q68.G 76.2,6.99 J42.2
ZERO_EN_14
  Top 0.406: Q73.G 52.07,6.99 J45.2
ZERO_EN_15
  Top 0.406: Q78.G 26.67,6.99 J48.2

## Text on the board
tPlace: VLED | +5V | GND | 7SEG_STATUS_1 | James Newman